# Altium schematic sheet GPIO.SchDoc
size A4
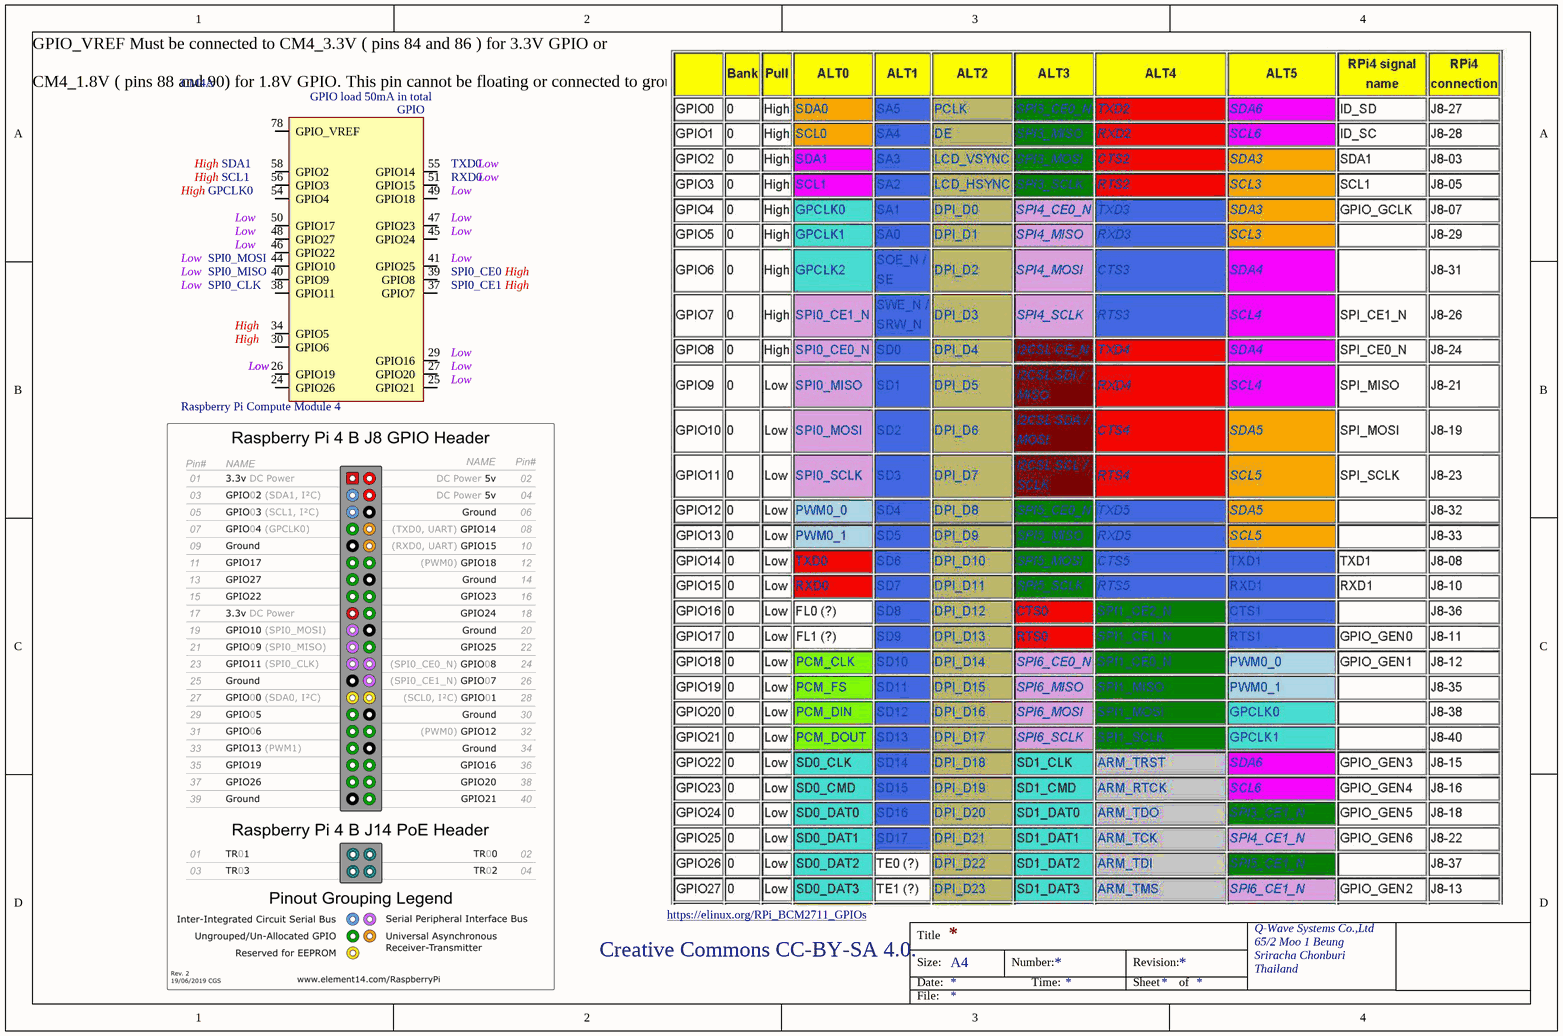
[diagram p0: GPIO.SchDoc]

## Parts
CM4  Raspberry Pi Compute Module 4  [CM4-F40C-100DS-0.4v_1.5mm_0mm]  (part A of 21)  (no BOM)

## Nets

Not connected (* = marked no-connect by the designer): CM4 24(GPIO26) 25(GPIO21) 26(GPIO19) 27(GPIO20) 29(GPIO16) 30(GPIO6) 34(GPIO5) 37(GPIO7) 38(GPIO11) 39(GPIO8) 40(GPIO9) 41(GPIO25) 44(GPIO10) 45(GPIO24) 46(GPIO22) 47(GPIO23) 48(GPIO27) 49(GPIO18) 50(GPIO17) 51(GPIO15) 54(GPIO4) 55(GPIO14) 56(GPIO3) 58(GPIO2) 78(GPIO_VREF)

## Notes on the sheet
- (near CM4) GPIO_VREF Must be connected to CM4_3.3V ( pins 84 and 86 ) for 3.3V GPIO or
  CM4_1.8V ( pins 88 and 90) for 1.8V GPIO. This pin cannot be floating or connected to ground
- https://elinux.org/RPi_BCM2711_GPIOs
- Creative Commons CC-BY-SA 4.0.
- Title
- Size:
- Date:
- A4
- Number:
- Time:
- Revision:
- Sheet
- of
- Q-Wave Systems Co.,Ltd
- 65/2 Moo 1 Beung
- Sriracha Chonburi
- Thailand
- File:
- (in symbol CM4, part A) GPIO load 50mA in total; GPIO; High; SDA1; TXD0; Low; SCL1; RXD0; GPCLK0; SPI0_MOSI; SPI0_MISO; SPI0_CE0; SPI0_CLK; SPI0_CE1; by Amornthep Phunsin

## Library data of the parts
CM4 = CM4: Raspberry Pi Compute Module 4 by Amornthep Phunsin